# Altium schematic sheet BattRead.SchDoc
size 157 x 101 mm; SheetNumber: 4; SheetTotal: 9
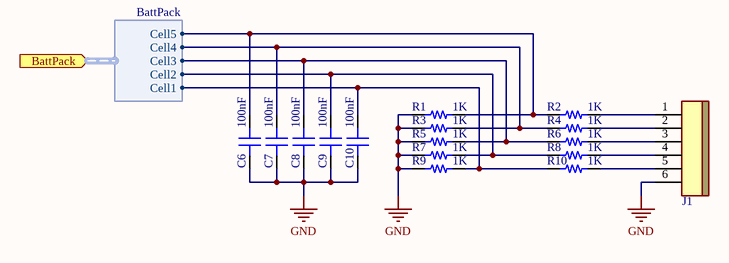
[diagram p0: BattRead.SchDoc]

## Parts
C6  100nF  [CAP 0603_1608]
C7  100nF  [CAP 0603_1608]
C8  100nF  [CAP 0603_1608]
C9  100nF  [CAP 0603_1608]
C10  100nF  [CAP 0603_1608]
J1  JST BxB-PH-K 6Pin  [JST B6B-PH-K]  (value not drawn)
R1  1K  [RES 0603_1608]
R2  1K  [RES 0603_1608]
R3  1K  [RES 0603_1608]
R4  1K  [RES 0603_1608]
R5  1K  [RES 0603_1608]
R6  1K  [RES 0603_1608]
R7  1K  [RES 0603_1608]
R8  1K  [RES 0603_1608]
R9  1K  [RES 0603_1608]
R10  1K  [RES 0603_1608]

## Ports
BattPack (in, harness BattPack)

## Harnesses
BattPack: Cell1, Cell2, Cell3, Cell4, Cell5

## Nets
GND: C6.1 C7.1 C8.1 C9.1 C10.1 J1.6 R1.1 R3.1 R5.1 R7.1 R9.1
NetC6_2: C6.2 R1.2 R2.1 ; port BattPack.Cell5
NetC7_2: C7.2 R3.2 R4.1 ; port BattPack.Cell4
NetC8_2: C8.2 R5.2 R6.1 ; port BattPack.Cell3
NetC9_2: C9.2 R7.2 R8.1 ; port BattPack.Cell2
NetC10_2: C10.2 R9.2 R10.1 ; port BattPack.Cell1
NetJ1_1: J1.1 R2.2
NetJ1_2: J1.2 R4.2
NetJ1_3: J1.3 R6.2
NetJ1_4: J1.4 R8.2
NetJ1_5: J1.5 R10.2

## Library data of the parts
C6-C10 = Cap 0603: SMT Capacitor; VALUE: 100nF
J1 = JST BxB-PH-K 6Pin: Connector Header Through Hole 0.079" (2.00mm); PartNumber: B6B-PH-K-S(LF)(SN)
R1-R10 = Res 0603: SMT Resistor; VALUE: 1K